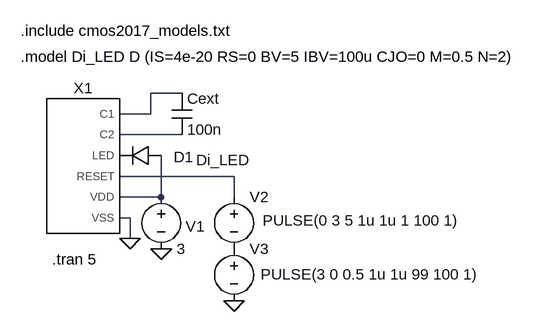
[diagram p0: schematic top.asc]
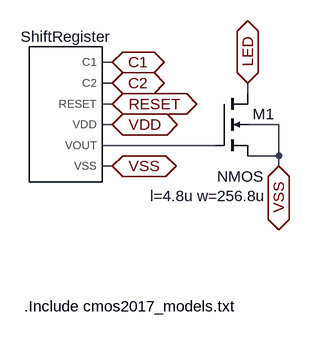
[diagram p1: sub-circuit output_driver.asc]
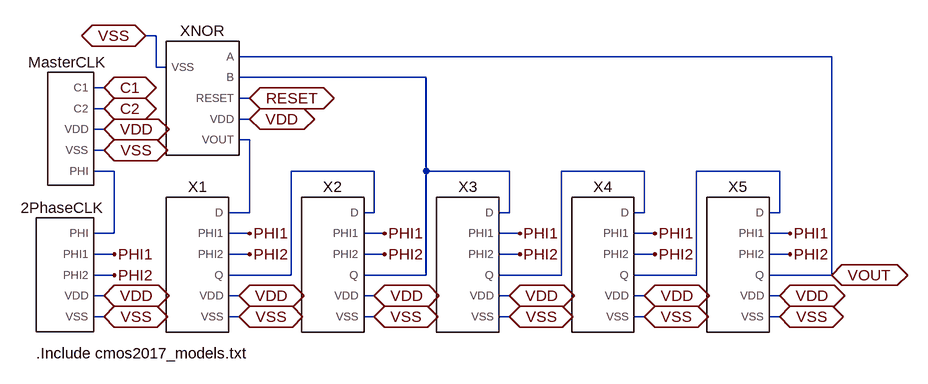
[diagram p2: sub-circuit prsd.asc]
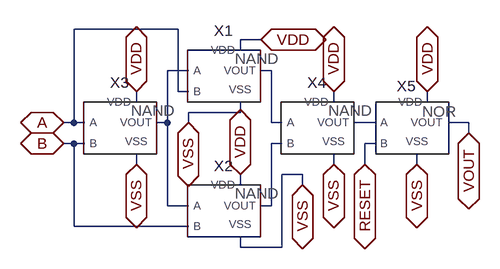
[diagram p3: sub-circuit xnor_reset.asc]
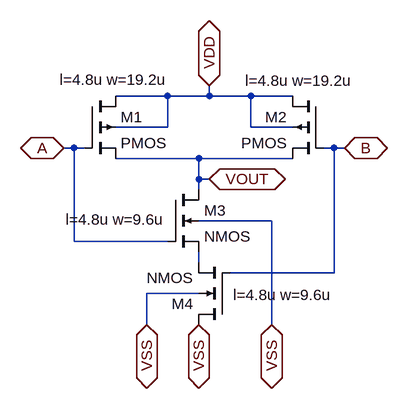
[diagram p4: sub-circuit nand.asc]
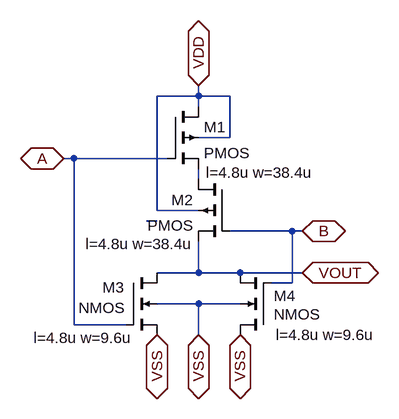
[diagram p5: sub-circuit nor.asc]
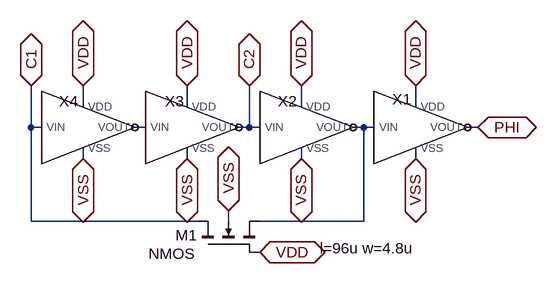
[diagram p6: sub-circuit master_clk.asc]
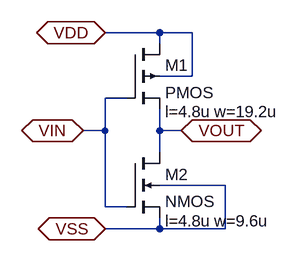
[diagram p7: sub-circuit invertor_jan20.asc]
top.asc, the LTspice schematic file:
Version 4
SHEET 1 1212 680
WIRE 272 64 224 64
WIRE 224 96 224 64
WIRE 224 96 176 96
WIRE 272 128 176 128
WIRE 352 192 176 192
WIRE 240 224 240 160
WIRE 240 224 176 224
WIRE 352 224 352 192
WIRE 192 256 176 256
WIRE 192 288 192 256
FLAG 192 288 0
FLAG 240 304 0
FLAG 352 384 0
SYMBOL cap 256 64 R0
SYMATTR InstName Cext
SYMATTR Value 100n
SYMBOL diode 240 144 R90
WINDOW 0 34 -35 VBottom 2
WINDOW 3 7 -95 VTop 2
SYMATTR InstName D1
SYMATTR Value Di_LED
SYMBOL voltage 240 208 R0
WINDOW 0 38 61 Left 2
WINDOW 123 0 0 Left 2
WINDOW 39 0 0 Left 2
SYMATTR InstName V1
SYMATTR Value 3
SYMBOL voltage 352 208 R0
WINDOW 123 0 0 Left 2
WINDOW 39 0 0 Left 2
WINDOW 3 44 52 Left 2
SYMATTR Value PULSE(0 3 5 1u 1u 1 100 1)
SYMATTR InstName V2
SYMBOL voltage 352 288 R0
WINDOW 123 0 0 Left 2
WINDOW 39 0 0 Left 2
WINDOW 3 41 55 Left 2
SYMATTR Value PULSE(3 0 0.5 1u 1u 99 100 1)
SYMATTR InstName V3
SYMBOL Output_Driver 112 176 R0
SYMATTR InstName X1
TEXT 24 8 Left 2 !.model Di_LED D (IS=4e-20 RS=0 BV=5 IBV=100u CJO=0 M=0.5 N=2)
TEXT 24 -32 Left 2 !.include cmos2017_models.txt
TEXT 72 320 Left 2 !.tran 5

output_driver.asc, the sub-circuit schematic file:
Version 4
SHEET 1 880 680
WIRE 144 64 128 64
WIRE 144 96 128 96
WIRE 352 112 352 96
WIRE 144 128 128 128
WIRE 144 160 128 160
WIRE 400 160 352 160
WIRE 304 192 128 192
WIRE 400 208 400 160
WIRE 400 208 352 208
WIRE 144 224 128 224
WIRE 400 224 400 208
FLAG 144 64 C1
IOPIN 144 64 BiDir
FLAG 144 96 C2
IOPIN 144 96 BiDir
FLAG 144 128 RESET
IOPIN 144 128 BiDir
FLAG 144 160 VDD
IOPIN 144 160 BiDir
FLAG 400 224 VSS
IOPIN 400 224 BiDir
FLAG 352 96 LED
IOPIN 352 96 BiDir
FLAG 144 224 VSS
IOPIN 144 224 BiDir
SYMBOL PRSD 64 144 R0
SYMATTR InstName ShiftRegister
SYMBOL nmos4 304 112 R0
WINDOW 123 -102 158 Left 2
WINDOW 3 1 128 Left 2
SYMATTR Value2 l=4.8u w=256.8u
SYMATTR InstName M1
TEXT 8 440 Left 2 !.Include cmos2017_models.txt

prsd.asc, the sub-circuit schematic file:
Version 4
SHEET 1 968 680
WIRE -272 -128 -288 -128
WIRE 768 -96 -144 -96
WIRE -272 -80 -272 -128
WIRE -256 -80 -272 -80
WIRE 144 -64 -144 -64
WIRE -352 -48 -368 -48
WIRE -128 -32 -144 -32
WIRE -352 -16 -368 -16
WIRE -128 0 -144 0
WIRE -352 16 -368 16
WIRE -128 32 -144 32
WIRE -352 48 -368 48
WIRE -336 80 -368 80
WIRE 64 80 -64 80
WIRE 144 80 144 -64
WIRE 272 80 144 80
WIRE 480 80 352 80
WIRE 688 80 560 80
WIRE -128 144 -128 32
WIRE -128 144 -160 144
WIRE 64 144 64 80
WIRE 64 144 48 144
WIRE 272 144 272 80
WIRE 272 144 256 144
WIRE 480 144 480 80
WIRE 480 144 464 144
WIRE 688 144 688 80
WIRE 688 144 672 144
WIRE -336 176 -336 80
WIRE -336 176 -368 176
WIRE -128 176 -160 176
WIRE 80 176 48 176
WIRE 288 176 256 176
WIRE 496 176 464 176
WIRE 704 176 672 176
WIRE -336 208 -368 208
WIRE -128 208 -160 208
WIRE 80 208 48 208
WIRE 288 208 256 208
WIRE 496 208 464 208
WIRE 704 208 672 208
WIRE -336 240 -368 240
WIRE -64 240 -64 80
WIRE -64 240 -160 240
WIRE 144 240 144 80
WIRE 144 240 48 240
WIRE 352 240 352 80
WIRE 352 240 256 240
WIRE 560 240 560 80
WIRE 560 240 464 240
WIRE 768 240 768 -96
WIRE 768 240 672 240
WIRE -352 272 -368 272
WIRE -144 272 -160 272
WIRE 64 272 48 272
WIRE 272 272 256 272
WIRE 480 272 464 272
WIRE 688 272 672 272
WIRE -352 304 -368 304
WIRE -144 304 -160 304
WIRE 64 304 48 304
WIRE 272 304 256 304
WIRE 480 304 464 304
WIRE 688 304 672 304
FLAG -336 208 PHI1
FLAG -336 240 PHI2
FLAG -352 16 VDD
IOPIN -352 16 BiDir
FLAG -352 48 VSS
IOPIN -352 48 BiDir
FLAG -352 272 VDD
IOPIN -352 272 BiDir
FLAG -352 304 VSS
IOPIN -352 304 BiDir
FLAG -128 176 PHI1
FLAG -128 208 PHI2
FLAG -128 0 VDD
IOPIN -128 0 BiDir
FLAG -144 272 VDD
IOPIN -144 272 BiDir
FLAG -144 304 VSS
IOPIN -144 304 BiDir
FLAG 64 272 VDD
IOPIN 64 272 BiDir
FLAG 64 304 VSS
IOPIN 64 304 BiDir
FLAG -128 -32 RESET
IOPIN -128 -32 BiDir
FLAG 272 272 VDD
IOPIN 272 272 BiDir
FLAG 272 304 VSS
IOPIN 272 304 BiDir
FLAG 480 272 VDD
IOPIN 480 272 BiDir
FLAG 480 304 VSS
IOPIN 480 304 BiDir
FLAG 688 272 VDD
IOPIN 688 272 BiDir
FLAG 688 304 VSS
IOPIN 688 304 BiDir
FLAG 80 176 PHI1
FLAG 80 208 PHI2
FLAG 288 176 PHI1
FLAG 288 208 PHI2
FLAG 496 176 PHI1
FLAG 496 208 PHI2
FLAG 704 176 PHI1
FLAG 704 208 PHI2
FLAG 768 240 VOUT
IOPIN 768 240 BiDir
FLAG -352 -48 C1
IOPIN -352 -48 BiDir
FLAG -352 -16 C2
IOPIN -352 -16 BiDir
FLAG -288 -128 VSS
IOPIN -288 -128 BiDir
SYMBOL XNOR_Reset -208 -32 R0
SYMATTR InstName XNOR
SYMBOL Master_CLK -368 48 R0
SYMATTR InstName MasterCLK
SYMBOL 2phase_CLK -416 272 R0
SYMATTR InstName 2PhaseCLK
SYMBOL Shift_Register -208 224 R0
SYMATTR InstName X1
SYMBOL Shift_Register 0 224 R0
SYMATTR InstName X2
SYMBOL Shift_Register 208 224 R0
SYMATTR InstName X3
SYMBOL Shift_Register 416 224 R0
SYMATTR InstName X4
SYMBOL Shift_Register 624 224 R0
SYMATTR InstName X5
TEXT -456 360 Left 2 !.Include cmos2017_models.txt

xnor_reset.asc, the sub-circuit schematic file:
Version 4
SHEET 1 880 680
WIRE -16 16 -176 16
WIRE 112 32 80 32
WIRE 80 48 80 32
WIRE 0 80 -32 80
WIRE 128 80 112 80
WIRE -16 112 -16 16
WIRE 0 112 -16 112
WIRE -80 128 -80 112
WIRE 224 128 224 112
WIRE 368 128 368 112
WIRE 80 144 80 128
WIRE 80 144 0 144
WIRE -176 160 -176 16
WIRE -176 160 -192 160
WIRE -160 160 -176 160
WIRE -32 160 -32 80
WIRE -32 160 -48 160
WIRE 0 160 0 144
WIRE 128 160 128 80
WIRE 144 160 128 160
WIRE 288 160 256 160
WIRE 432 160 400 160
WIRE 432 176 432 160
WIRE -176 192 -192 192
WIRE -160 192 -176 192
WIRE 144 192 128 192
WIRE 288 192 272 192
WIRE -80 224 -80 208
WIRE 224 224 224 208
WIRE 272 224 272 192
WIRE 352 224 352 208
WIRE 176 240 144 240
WIRE 80 256 80 240
WIRE 176 256 176 240
WIRE -32 288 -32 160
WIRE 0 288 -32 288
WIRE 128 288 128 192
WIRE 128 288 112 288
WIRE -176 320 -176 192
WIRE 0 320 -176 320
WIRE 80 352 80 336
WIRE 144 352 144 240
WIRE 144 352 80 352
FLAG 112 32 VDD
IOPIN 112 32 BiDir
FLAG 80 240 VDD
IOPIN 80 240 BiDir
FLAG -80 112 VDD
IOPIN -80 112 BiDir
FLAG 224 112 VDD
IOPIN 224 112 BiDir
FLAG 368 112 VDD
IOPIN 368 112 BiDir
FLAG -192 160 A
IOPIN -192 160 BiDir
FLAG -192 192 B
IOPIN -192 192 BiDir
FLAG 272 224 RESET
IOPIN 272 224 BiDir
FLAG 432 176 VOUT
IOPIN 432 176 BiDir
FLAG -80 224 VSS
IOPIN -80 224 BiDir
FLAG 0 160 VSS
IOPIN 0 160 BiDir
FLAG 176 256 VSS
IOPIN 176 256 BiDir
FLAG 224 224 VSS
IOPIN 224 224 BiDir
FLAG 352 224 VSS
IOPIN 352 224 BiDir
SYMBOL nand 48 96 R0
SYMATTR InstName X1
SYMBOL nand 48 304 R0
SYMATTR InstName X2
SYMBOL nand -112 176 R0
SYMATTR InstName X3
SYMBOL nand 192 176 R0
SYMATTR InstName X4
SYMBOL nor 336 176 R0
SYMATTR InstName X5

nand.asc, the sub-circuit schematic file:
Version 4
SHEET 1 880 680
WIRE 208 32 128 32
WIRE 272 32 272 16
WIRE 272 32 208 32
WIRE 336 32 272 32
WIRE 400 32 336 32
WIRE 208 80 208 32
WIRE 208 80 128 80
WIRE 336 80 336 32
WIRE 400 80 336 80
WIRE 64 112 48 112
WIRE 80 112 64 112
WIRE 464 112 448 112
WIRE 480 112 464 112
WIRE 256 128 128 128
WIRE 400 128 256 128
WIRE 256 160 256 128
WIRE 272 160 256 160
WIRE 256 176 256 160
WIRE 368 224 256 224
WIRE 64 256 64 112
WIRE 208 256 64 256
WIRE 256 288 256 272
WIRE 464 304 464 112
WIRE 464 304 304 304
WIRE 256 336 176 336
WIRE 176 384 176 336
WIRE 368 384 368 224
FLAG 256 384 VSS
IOPIN 256 384 BiDir
FLAG 48 112 A
IOPIN 48 112 BiDir
FLAG 480 112 B
IOPIN 480 112 BiDir
FLAG 176 384 VSS
IOPIN 176 384 BiDir
FLAG 272 16 VDD
IOPIN 272 16 BiDir
FLAG 368 384 VSS
IOPIN 368 384 BiDir
FLAG 272 160 VOUT
IOPIN 272 160 BiDir
SYMBOL pmos4 80 32 R0
WINDOW 123 -38 -25 Left 2
SYMATTR Value2 l=4.8u w=19.2u
SYMATTR InstName M1
SYMBOL pmos4 448 32 M0
WINDOW 123 -45 -24 Left 2
SYMATTR Value2 l=4.8u w=19.2u
SYMATTR InstName M2
SYMBOL nmos4 208 176 R0
WINDOW 123 -157 46 Left 2
SYMATTR Value2 l=4.8u w=9.6u
SYMATTR InstName M3
SYMBOL nmos4 304 384 R180
WINDOW 123 -157 46 Left 2
SYMATTR Value2 l=4.8u w=9.6u
SYMATTR InstName M4

nor.asc, the sub-circuit schematic file:
Version 4
SHEET 1 888 680
WIRE 400 -112 400 -128
WIRE 400 -112 336 -112
WIRE 448 -112 400 -112
WIRE 400 -96 400 -112
WIRE 448 -48 448 -112
WIRE 448 -48 400 -48
WIRE 208 -16 192 -16
WIRE 352 -16 208 -16
WIRE 400 16 400 0
WIRE 336 64 336 -112
WIRE 400 64 336 64
WIRE 336 80 320 80
WIRE 544 96 448 96
WIRE 560 96 544 96
WIRE 400 160 400 112
WIRE 400 160 336 160
WIRE 464 160 400 160
WIRE 560 160 464 160
WIRE 544 176 544 96
WIRE 544 176 512 176
WIRE 400 208 336 208
WIRE 464 208 400 208
WIRE 208 240 208 -16
WIRE 288 240 208 240
WIRE 400 256 400 208
FLAG 192 -16 A
IOPIN 192 -16 BiDir
FLAG 560 96 B
IOPIN 560 96 BiDir
FLAG 400 -128 VDD
IOPIN 400 -128 BiDir
FLAG 560 160 VOUT
IOPIN 560 160 BiDir
FLAG 336 256 VSS
IOPIN 336 256 BiDir
FLAG 464 256 VSS
IOPIN 464 256 BiDir
FLAG 400 256 VSS
IOPIN 400 256 BiDir
SYMBOL pmos4 352 -96 R0
WINDOW 123 59 102 Left 2
SYMATTR Value2 l=4.8u w=38.4u
SYMATTR InstName M1
SYMBOL pmos4 448 16 M0
WINDOW 123 56 100 Left 2
WINDOW 3 56 71 Left 2
SYMATTR Value2 l=4.8u w=38.4u
SYMATTR InstName M2
SYMBOL nmos4 288 160 R0
WINDOW 123 -142 100 Left 2
WINDOW 0 -36 23 Left 2
WINDOW 3 -73 54 Left 2
SYMATTR Value2 l=4.8u w=9.6u
SYMATTR InstName M3
SYMBOL nmos4 512 256 R180
WINDOW 123 -159 0 Left 2
WINDOW 0 -38 60 Left 2
WINDOW 3 -76 32 Left 2
SYMATTR Value2 l=4.8u w=9.6u
SYMATTR InstName M4

master_clk.asc, the sub-circuit schematic file:
Version 4
SHEET 1 880 680
WIRE -112 96 -112 64
WIRE 48 96 48 64
WIRE 224 96 224 64
WIRE 400 96 400 64
WIRE -192 128 -192 64
WIRE -176 128 -192 128
WIRE -16 128 -32 128
WIRE 144 128 144 64
WIRE 144 128 128 128
WIRE 160 128 144 128
WIRE 320 128 304 128
WIRE 336 128 320 128
WIRE 496 128 480 128
WIRE -112 176 -112 160
WIRE 48 176 48 160
WIRE 224 176 224 160
WIRE 400 176 400 160
WIRE -192 272 -192 128
WIRE 64 272 -192 272
WIRE 112 272 112 256
WIRE 320 272 320 128
WIRE 320 272 160 272
WIRE 160 320 144 320
FLAG -112 64 VDD
IOPIN -112 64 BiDir
FLAG 48 64 VDD
IOPIN 48 64 BiDir
FLAG 224 64 VDD
IOPIN 224 64 BiDir
FLAG 400 64 VDD
IOPIN 400 64 BiDir
FLAG 160 320 VDD
IOPIN 160 320 BiDir
FLAG 144 64 C2
IOPIN 144 64 BiDir
FLAG -112 176 VSS
IOPIN -112 176 BiDir
FLAG 48 176 VSS
IOPIN 48 176 BiDir
FLAG 224 176 VSS
IOPIN 224 176 BiDir
FLAG 400 176 VSS
IOPIN 400 176 BiDir
FLAG -192 64 C1
IOPIN -192 64 BiDir
FLAG 496 128 PHI
IOPIN 496 128 BiDir
FLAG 112 256 VSS
IOPIN 112 256 BiDir
SYMBOL Invertor_Jan20 400 128 R0
WINDOW 0 -21 -28 Bottom 2
SYMATTR InstName X1
SYMBOL Invertor_Jan20 224 128 R0
WINDOW 0 -21 -25 Bottom 2
SYMATTR InstName X2
SYMBOL Invertor_Jan20 48 128 R0
WINDOW 0 -19 -25 Bottom 2
SYMATTR InstName X3
SYMBOL Invertor_Jan20 -112 128 R0
WINDOW 0 -22 -25 Bottom 2
SYMATTR InstName X4
SYMBOL nmos4 64 320 R270
WINDOW 123 6 189 VRight 2
WINDOW 0 26 -34 VRight 2
WINDOW 3 -2 -75 VRight 2
SYMATTR Value2 l=96u w=4.8u
SYMATTR InstName M1

invertor_jan20.asc, the sub-circuit schematic file:
Version 4
SHEET 1 880 680
WIRE 192 0 112 0
WIRE 240 0 192 0
WIRE 192 16 192 0
WIRE 240 64 240 0
WIRE 240 64 192 64
WIRE 144 96 112 96
WIRE 112 144 112 96
WIRE 112 144 80 144
WIRE 192 144 192 112
WIRE 224 144 192 144
WIRE 192 176 192 144
WIRE 288 224 192 224
WIRE 112 256 112 144
WIRE 144 256 112 256
WIRE 192 288 192 272
WIRE 192 288 112 288
WIRE 288 288 288 224
WIRE 288 288 192 288
FLAG 80 144 VIN
IOPIN 80 144 BiDir
FLAG 224 144 VOUT
IOPIN 224 144 BiDir
FLAG 112 0 VDD
IOPIN 112 0 BiDir
FLAG 112 288 VSS
IOPIN 112 288 BiDir
SYMBOL pmos4 144 16 R0
WINDOW 123 56 100 Left 2
SYMATTR Value2 l=4.8u w=19.2u
SYMATTR InstName M1
SYMBOL nmos4 144 176 R0
WINDOW 123 56 100 Left 2
SYMATTR Value2 l=4.8u w=9.6u
SYMATTR InstName M2

2phase_clk.asc, the sub-circuit schematic file:
Version 4
SHEET 1 1068 816
WIRE 112 80 96 80
WIRE 256 80 240 80
WIRE 416 80 400 80
WIRE 592 80 576 80
WIRE 96 128 96 80
WIRE 240 128 240 80
WIRE 400 128 400 80
WIRE 576 128 576 80
WIRE -176 160 -176 144
WIRE 16 160 -176 160
WIRE 176 160 128 160
WIRE 336 160 320 160
WIRE 496 160 480 160
WIRE 512 160 496 160
WIRE 672 160 656 160
WIRE 16 192 0 192
WIRE 96 240 96 208
WIRE 112 240 96 240
WIRE 240 240 240 192
WIRE 256 240 240 240
WIRE 400 240 400 192
WIRE 416 240 400 240
WIRE 576 240 576 192
WIRE 592 240 576 240
WIRE 496 272 496 160
WIRE 496 272 -16 272
WIRE 0 288 0 192
WIRE 496 288 0 288
WIRE 112 320 96 320
WIRE 256 320 240 320
WIRE 416 320 400 320
WIRE 592 320 576 320
WIRE 96 368 96 320
WIRE 240 368 240 320
WIRE 400 368 400 320
WIRE 576 368 576 320
WIRE -96 400 -96 368
WIRE -16 400 -16 272
WIRE 16 400 -16 400
WIRE 176 400 128 400
WIRE 336 400 320 400
WIRE 496 400 496 288
WIRE 496 400 480 400
WIRE 512 400 496 400
WIRE 672 400 656 400
WIRE -176 432 -176 160
WIRE -160 432 -176 432
WIRE 16 432 -16 432
WIRE 96 480 96 448
WIRE 112 480 96 480
WIRE 240 480 240 432
WIRE 256 480 240 480
WIRE 400 480 400 432
WIRE 416 480 400 480
WIRE 576 480 576 432
WIRE 592 480 576 480
WIRE -96 496 -96 464
WIRE -80 496 -96 496
FLAG 112 80 VDD
IOPIN 112 80 BiDir
FLAG 256 80 VDD
IOPIN 256 80 BiDir
FLAG 416 80 VDD
IOPIN 416 80 BiDir
FLAG 592 80 VDD
IOPIN 592 80 BiDir
FLAG 112 320 VDD
IOPIN 112 320 BiDir
FLAG 256 320 VDD
IOPIN 256 320 BiDir
FLAG 416 320 VDD
IOPIN 416 320 BiDir
FLAG 592 320 VDD
IOPIN 592 320 BiDir
FLAG -96 368 VDD
IOPIN -96 368 BiDir
FLAG 256 240 VSS
IOPIN 256 240 BiDir
FLAG 416 240 VSS
IOPIN 416 240 BiDir
FLAG 592 240 VSS
IOPIN 592 240 BiDir
FLAG -80 496 VSS
IOPIN -80 496 BiDir
FLAG 256 480 VSS
IOPIN 256 480 BiDir
FLAG 416 480 VSS
IOPIN 416 480 BiDir
FLAG 592 480 VSS
IOPIN 592 480 BiDir
FLAG -176 144 PHI
IOPIN -176 144 BiDir
FLAG 672 160 PHI1
IOPIN 672 160 BiDir
FLAG 672 400 PHI2
IOPIN 672 400 BiDir
FLAG 112 240 VSS
IOPIN 112 240 BiDir
FLAG 112 480 VSS
IOPIN 112 480 BiDir
SYMBOL Invertor_Jan20 240 160 R0
WINDOW 0 -26 -29 Bottom 2
SYMATTR InstName X1
SYMBOL nand 64 176 R0
WINDOW 0 -44 -54 Bottom 2
SYMATTR InstName X2
SYMBOL nand 64 416 R0
WINDOW 0 -45 -51 Bottom 2
SYMATTR InstName X3
SYMBOL Invertor_Jan20 -96 432 R0
WINDOW 0 -28 -31 Bottom 2
SYMATTR InstName X4
SYMBOL Invertor_Jan20 240 400 R0
WINDOW 0 -33 -30 Bottom 2
SYMATTR InstName X5
SYMBOL Invertor_Jan20 400 160 R0
WINDOW 0 -31 -30 Bottom 2
SYMATTR InstName X6
SYMBOL Invertor_Jan20 400 400 R0
WINDOW 0 -29 -30 Bottom 2
SYMATTR InstName X7
SYMBOL Invertor_Jan20 576 160 R0
WINDOW 0 -30 -30 Bottom 2
SYMATTR InstName X8
SYMBOL Invertor_Jan20 576 400 R0
WINDOW 0 -26 -29 Bottom 2
SYMATTR InstName X9

shift_register.asc, the sub-circuit schematic file:
Version 4
SHEET 1 880 680
WIRE -112 48 -160 48
WIRE -96 48 -112 48
WIRE 240 48 192 48
WIRE 256 48 240 48
WIRE -112 96 -112 48
WIRE -112 96 -160 96
WIRE 240 96 240 48
WIRE 240 96 192 96
WIRE -208 128 -240 128
WIRE 144 128 112 128
WIRE -160 192 -160 144
WIRE 0 192 -160 192
WIRE 192 192 192 144
WIRE 240 192 192 192
WIRE -352 208 -352 192
WIRE 0 208 0 192
WIRE -160 224 -160 192
WIRE 192 224 192 192
WIRE -128 272 -160 272
WIRE 240 272 192 272
WIRE -240 304 -240 128
WIRE -240 304 -352 304
WIRE -208 304 -240 304
WIRE 112 304 112 128
WIRE 112 304 0 304
WIRE 144 304 112 304
WIRE -128 320 -128 272
WIRE -128 320 -160 320
WIRE 240 320 240 272
WIRE 240 320 192 320
WIRE -400 336 -400 288
WIRE -160 336 -160 320
WIRE -48 336 -48 288
WIRE 192 336 192 320
FLAG -400 336 PHI1
IOPIN -400 336 BiDir
FLAG -48 336 PHI2
IOPIN -48 336 BiDir
FLAG -352 192 D
IOPIN -352 192 BiDir
FLAG -96 48 VDD
IOPIN -96 48 BiDir
FLAG 256 48 VDD
IOPIN 256 48 BiDir
FLAG -160 336 VSS
IOPIN -160 336 BiDir
FLAG 192 336 VSS
IOPIN 192 336 BiDir
FLAG 240 192 Q
IOPIN 240 192 BiDir
FLAG -352 256 VSS
IOPIN -352 256 BiDir
FLAG 0 256 VSS
IOPIN 0 256 BiDir
SYMBOL pmos4 144 48 R0
WINDOW 123 56 92 Left 2
WINDOW 3 56 64 Left 2
SYMATTR Value2 l=4.8u w=19.2u
SYMATTR InstName M1
SYMBOL pmos4 -208 48 R0
WINDOW 123 57 92 Left 2
WINDOW 3 56 65 Left 2
SYMATTR Value2 l=4.8u w=19.2u
SYMATTR InstName M2
SYMBOL nmos4 -208 224 R0
WINDOW 123 -18 -7 Left 2
WINDOW 3 57 63 Left 2
SYMATTR Value2 l=4.8u w=9.6u
SYMATTR InstName M3
SYMBOL nmos4 -48 208 R0
WINDOW 123 12 113 Left 2
WINDOW 0 56 20 Left 2
SYMATTR Value2 l=16.8u w=9.6u
SYMATTR InstName M4
SYMBOL nmos4 144 224 R0
WINDOW 123 -17 -5 Left 2
WINDOW 3 55 64 Left 2
SYMATTR Value2 l=4.8u w=9.6u
SYMATTR InstName M5
SYMBOL nmos4 -400 208 R0
WINDOW 123 4 114 Left 2
WINDOW 0 56 20 Left 2
SYMATTR Value2 l=16.8u w=9.6u
SYMATTR InstName M6

The netlist it stands for:
* top.asc
Cext N001 N002 100n
D1 N004 P001 Di_LED
V1 N004 0 3
V2 N003 P002 PULSE(0 3 5 1u 1u 1 100 1)
V3 P002 0 PULSE(3 0 0.5 1u 1u 99 100 1)
XX1 N001 N002 P001 N003 N004 0 output_driver

* block symbol definitions
.subckt output_driver C1 C2 LED RESET VDD VSS
XShiftRegister C1 C2 RESET VDD N001 VSS prsd
M1 LED N001 VSS VSS NMOS l=4.8u w=256.8u
.Include cmos2017_models.txt
.ends output_driver

.subckt prsd C1 C2 RESET VDD VOUT VSS
XXNOR VOUT N001 RESET VDD N002 VSS xnor_reset
XMasterCLK C1 C2 VDD VSS N003 master_clk
X2PhaseCLK N003 PHI1 PHI2 VDD VSS 2phase_clk
XX1 N002 PHI1 PHI2 N004 VDD VSS shift_register
XX2 N004 PHI1 PHI2 N001 VDD VSS shift_register
XX3 N001 PHI1 PHI2 N005 VDD VSS shift_register
XX4 N005 PHI1 PHI2 N006 VDD VSS shift_register
XX5 N006 PHI1 PHI2 VOUT VDD VSS shift_register
.Include cmos2017_models.txt
.ends prsd

.subckt xnor_reset A B RESET VDD VOUT VSS
XX1 N001 A VDD N002 VSS nand
XX2 N001 B VDD N004 VSS nand
XX3 A B VDD N001 VSS nand
XX4 N002 N004 VDD N003 VSS nand
XX5 N003 RESET VDD VOUT VSS nor
.ends xnor_reset

.subckt nand A B VDD VOUT VSS
M1 VDD A VOUT VDD PMOS l=4.8u w=19.2u
M2 VDD B VOUT VDD PMOS l=4.8u w=19.2u
M3 VOUT A N001 VSS NMOS l=4.8u w=9.6u
M4 VSS B N001 VSS NMOS l=4.8u w=9.6u
.ends nand

.subckt nor A B VDD VOUT VSS
M1 VDD A N001 VDD PMOS l=4.8u w=38.4u
M2 N001 B VOUT VDD PMOS l=4.8u w=38.4u
M3 VOUT A VSS VSS NMOS l=4.8u w=9.6u
M4 VSS B VOUT VSS NMOS l=4.8u w=9.6u
.ends nor

.subckt master_clk C1 C2 VDD VSS PHI
XX1 VDD N002 VSS PHI invertor_jan20
XX2 VDD C2 VSS N002 invertor_jan20
XX3 VDD N001 VSS C2 invertor_jan20
XX4 VDD C1 VSS N001 invertor_jan20
M1 C1 VDD N002 VSS NMOS l=96u w=4.8u
.ends master_clk

.subckt invertor_jan20 VDD VIN VSS VOUT
M1 VDD VIN VOUT VDD PMOS l=4.8u w=19.2u
M2 VOUT VIN VSS VSS NMOS l=4.8u w=9.6u
.ends invertor_jan20

.subckt 2phase_clk PHI PHI1 PHI2 VDD VSS
XX1 VDD N001 VSS N002 invertor_jan20
XX2 PHI N004 VDD N001 VSS nand
XX3 N003 N007 VDD N005 VSS nand
XX4 VDD PHI VSS N007 invertor_jan20
XX5 VDD N005 VSS N006 invertor_jan20
XX6 VDD N002 VSS N003 invertor_jan20
XX7 VDD N006 VSS N004 invertor_jan20
XX8 VDD N003 VSS PHI1 invertor_jan20
XX9 VDD N004 VSS PHI2 invertor_jan20
.ends 2phase_clk

.subckt shift_register D PHI1 PHI2 Q VDD VSS
M1 VDD N002 Q VDD PMOS l=4.8u w=19.2u
M2 VDD N001 N003 VDD PMOS l=4.8u w=19.2u
M3 N003 N001 VSS VSS NMOS l=4.8u w=9.6u
M4 N003 PHI2 N002 VSS NMOS l=16.8u w=9.6u
M5 Q N002 VSS VSS NMOS l=4.8u w=9.6u
M6 D PHI1 N001 VSS NMOS l=16.8u w=9.6u
.ends shift_register

.model D D
.lib standard.dio
.model NMOS NMOS
.model PMOS PMOS
.lib standard.mos
.model Di_LED D (IS=4e-20 RS=0 BV=5 IBV=100u CJO=0 M=0.5 N=2)
.include cmos2017_models.txt
.tran 5
.backanno
.end